# Altium schematic sheet ver061_ADC.SchDoc
size A3; SheetNumber: 2; SheetTotal: 6
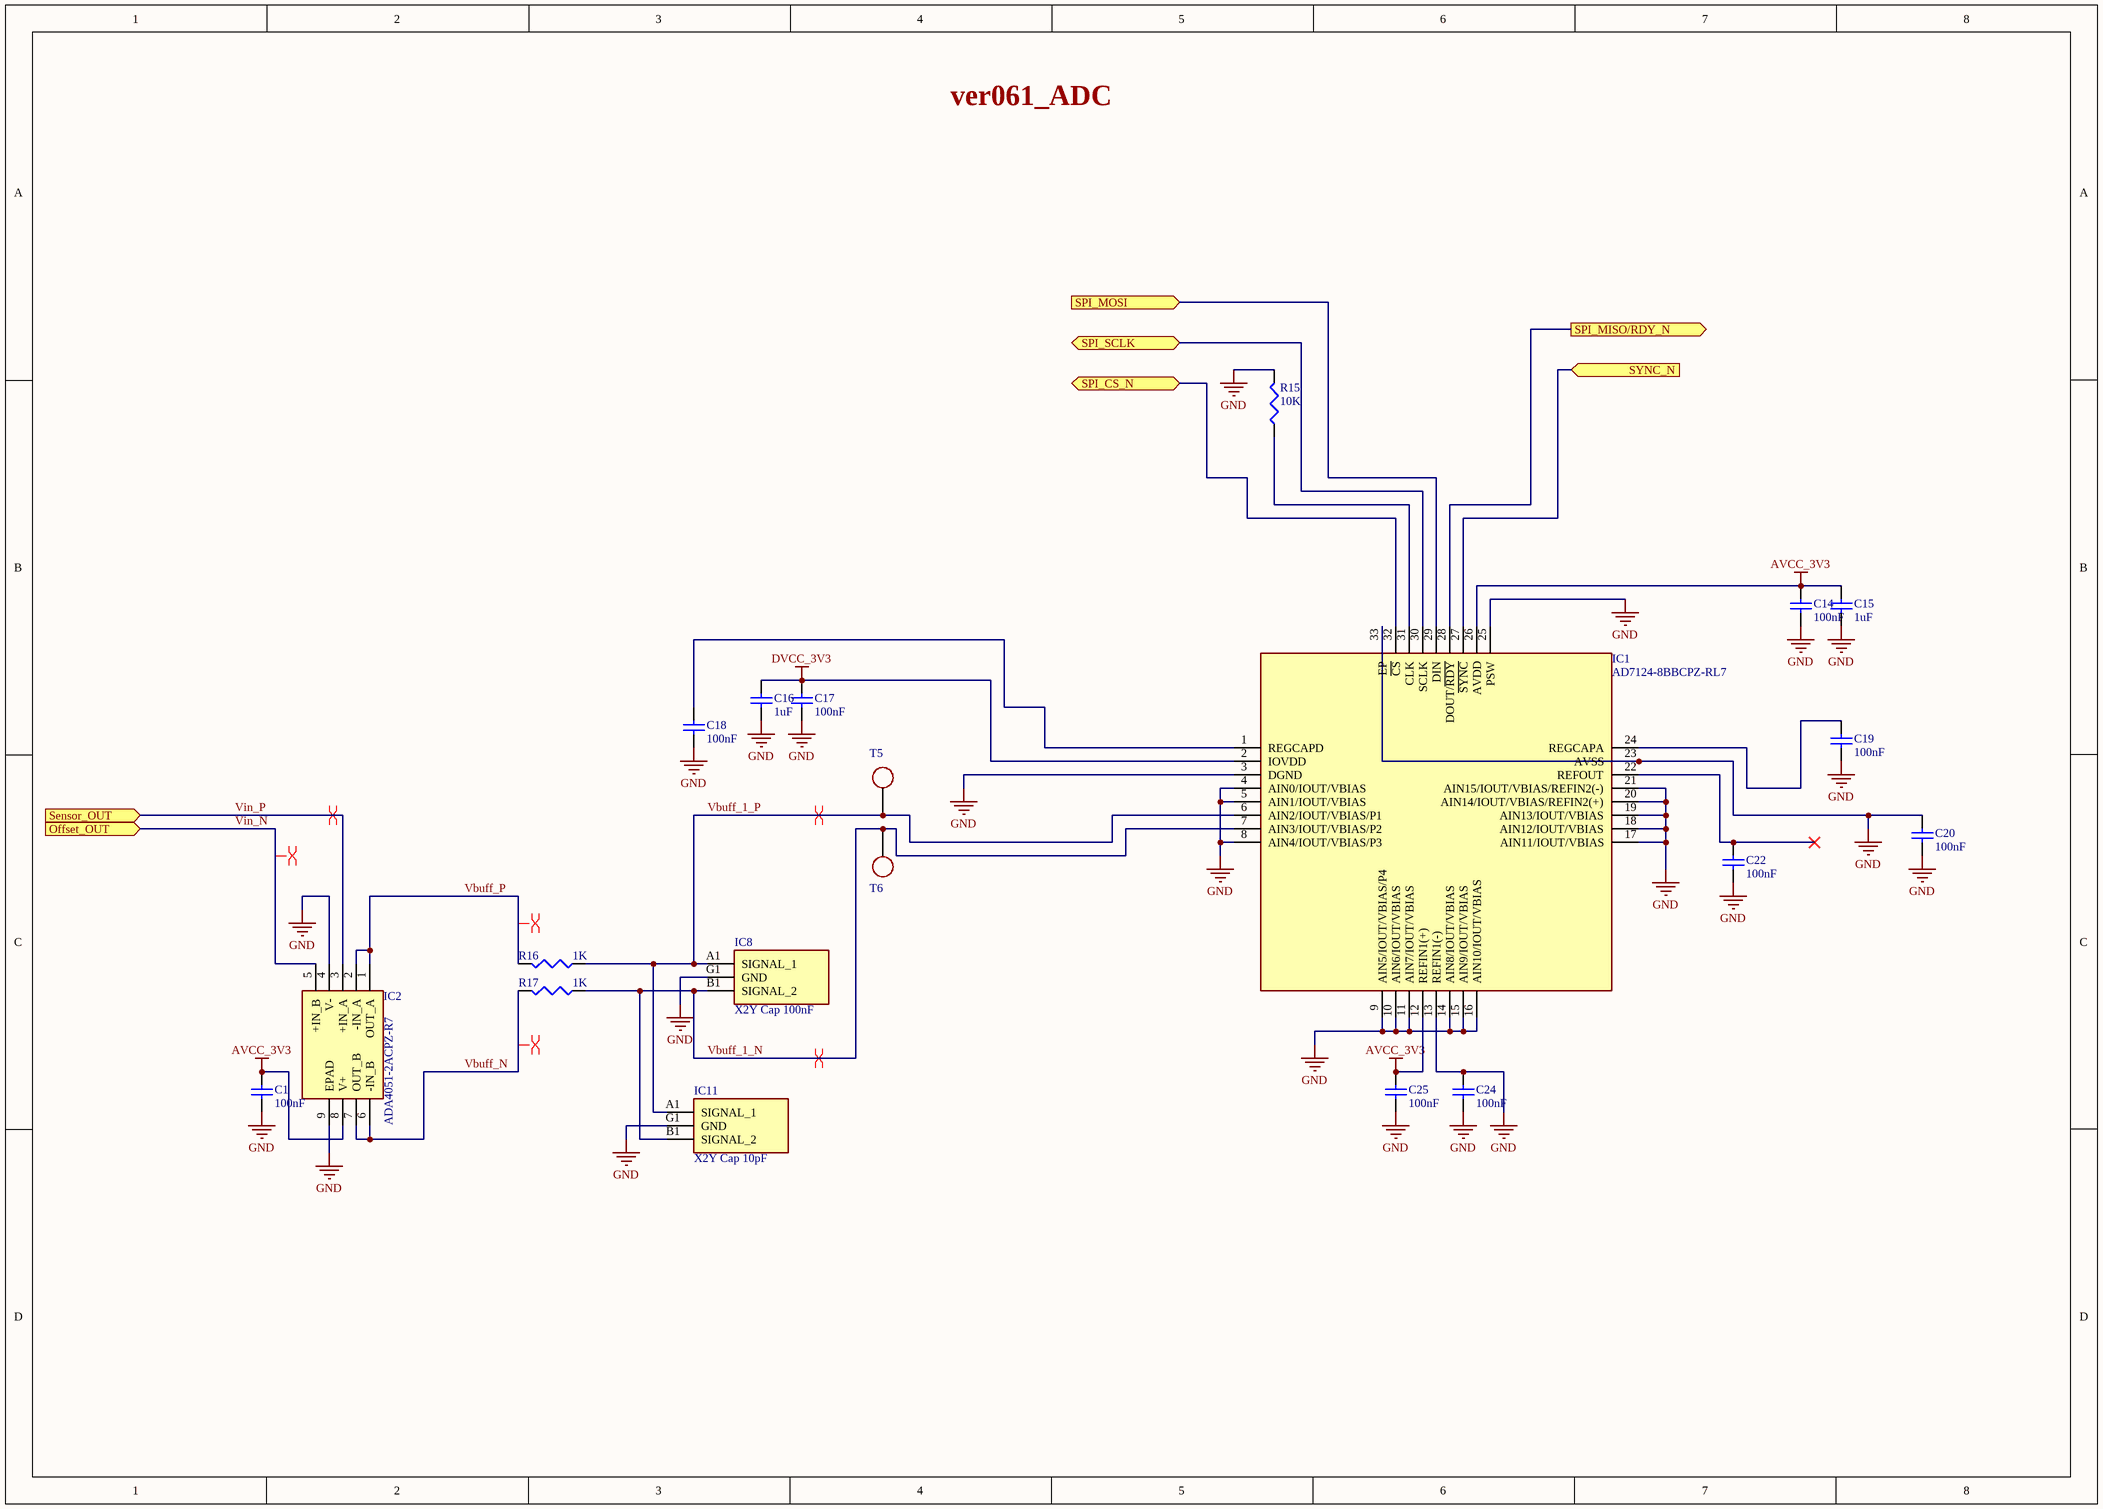
[diagram p0: ver061_ADC.SchDoc]

## Parts
C1  value 100nF  [1608[0603]]  (hidden comment: Cap Semi)
C14  value 100nF  [0402]  (hidden comment: Cap Semi)
C15  value 1uF  [0402]  (hidden comment: Cap Semi)
C16  value 1uF  [0402]  (hidden comment: Cap Semi)
C17  value 100nF  [0402]  (hidden comment: Cap Semi)
C18  value 100nF  [0402]  (hidden comment: Cap Semi)
C19  value 100nF  [0402]  (hidden comment: Cap Semi)
C20  value 100nF  [0402]  (hidden comment: Cap Semi)
C22  value 100nF  [0402]  (hidden comment: Cap Semi)
C24  value 100nF  [0402]  (hidden comment: Cap Semi)
C25  value 100nF  [0402]  (hidden comment: Cap Semi)
IC1  AD7124-8BBCPZ-RL7  [QFN50P500X500X100-33N-D]
IC2  ADA4051-2ACPZ-R7  [DFN300X300X90-9N]
IC8  X2Y Cap 100nF  [500X14W102MV4T]
IC11  X2Y Cap 10pF  [500X14W102MV4T]
R15  value 10K  [RESC1005X35N]  (hidden comment: Res3)
R16  value 1K  [RESC1005X35N]  (hidden comment: Res3)
R17  value 1K  [RESC1005X35N]  (hidden comment: Res3)
T5  TP_SMT  [TP_SMT_Round_0.6x0.6]  (value not drawn)
T6  TP_SMT  [TP_SMT_Round_0.6x0.6]  (value not drawn)

## Ports
Offset_OUT (in), Sensor_OUT (in), SPI_CS_N (bidir), SPI_MISO/RDY_N (out), SPI_MOSI (in), SPI_SCLK (bidir), SYNC_N (in)

## Nets
AVCC_3V3: C1.1 C14.1 C15.1 C25.1 IC1.12(REFIN1(+)) IC1.26(AVDD) IC2.8(V+)
DVCC_3V3: C16.1 C17.1 IC1.2(IOVDD)
GND: C1.2 C14.2 C15.2 C16.2 C17.2 C18.2 C19.2 C20.1 C20.2 C22.2 C24.1 C24.2 C25.2 IC1.3(DGND) IC1.4(AIN0/IOUT/VBIAS) IC1.5(AIN1/IOUT/VBIAS) IC1.8(AIN4/IOUT/VBIAS/P3) IC1.9(AIN5/IOUT/VBIAS/P4) IC1.10(AIN6/IOUT/VBIAS) IC1.11(AIN7/IOUT/VBIAS) IC1.13(REFIN1(-)) IC1.14(AIN8/IOUT/VBIAS) IC1.15(AIN9/IOUT/VBIAS) IC1.16(AIN10/IOUT/VBIAS) IC1.17(AIN11/IOUT/VBIAS) IC1.18(AIN12/IOUT/VBIAS) IC1.19(AIN13/IOUT/VBIAS) IC1.20(AIN14/IOUT/VBIAS/REFIN2(+)) IC1.21(AIN15/IOUT/VBIAS/REFIN2(-)) IC1.23(AVSS) IC1.25(PSW) IC1.33(EP) IC2.4(V-) IC2.9(EPAD) IC8.G1(GND) IC11.G1(GND) R15.2
SPI_CS_N: IC1.32(~{CS}) ; port SPI_CS_N
SPI_MISO/RDY_N: IC1.28(DOUT/~{RDY}) ; port SPI_MISO/RDY_N
SPI_MOSI: IC1.29(DIN) ; port SPI_MOSI
SPI_SCLK: IC1.30(SCLK) ; port SPI_SCLK
SYNC_N: IC1.27(~{SYNC}) ; port SYNC_N
Vbuff_1_N: IC1.7(AIN3/IOUT/VBIAS/P2) IC8.B1(SIGNAL_2) IC11.B1(SIGNAL_2) R17.1 T6.1
Vbuff_1_P: IC1.6(AIN2/IOUT/VBIAS/P1) IC8.A1(SIGNAL_1) IC11.A1(SIGNAL_1) R16.1 T5.1
Vbuff_N: IC2.6(-IN_B) IC2.7(OUT_B) R17.2
Vbuff_P: IC2.1(OUT_A) IC2.2(-IN_A) R16.2
Vin_N: IC2.5(+IN_B) ; port Offset_OUT
Vin_P: IC2.3(+IN_A) ; port Sensor_OUT
NetC18_1: C18.1 IC1.1(REGCAPD)
NetC19_1: C19.1 IC1.24(REGCAPA)
NetC22_1: C22.1 IC1.22(REFOUT)
NetIC1_31: IC1.31(CLK) R15.1

## Layout directives
differential pair: Vbuff_1_N, Vbuff_1_P, Vbuff_N, Vbuff_P, Vin_N, Vin_P

## Notes on the sheet
- ver061_ADC

## Library data of the parts
C1 C14-C20 C22 C24 C25 = Cap Semi: Capacitor (Semiconductor SIM Model); Published: 8-Jun-2000; LatestRevisionDate: 29-May-2009; LatestRevisionNote: IPC-7351 Footprint Added.; PackageReference: C1206; Publisher: Altium Limited; PackageDescription: Chip Capacitor
IC1 = AD7124-8BBCPZ-RL7: Integrated Circuit; Manufacturer_Name: Analog Devices; Datasheet Link: https://www.analog.com/media/en/technical-documentation/data-sheets/ad7124-8.pdf; Height: 1mm; Manufacturer_Part_Number: AD7124-8BBCPZ-RL7; Mouser Part Number: 584-AD7124-8BBCPZRL7; Mouser Price/Stock: https://www.mouser.co.uk/ProductDetail/Analog-Devices/AD7124-8BBCPZ-RL7?qs=wUXugUrL1qzAxcMt7nmw0w%3D%3D; Arrow Part Number: AD7124-8BBCPZ-RL7; Arrow Price/Stock: https://www.arrow.com/en/products/ad7124-8bbcpz-rl7/analog-devices?region=nac
IC2 = ADA4051-2ACPZ-R7: Integrated Circuit; Manufacturer_Name: Analog Devices; Manufacturer_Part_Number: ADA4051-2ACPZ-R7; Mouser Part Number: 584-ADA4051-2ACPZ-R7; Mouser Price/Stock: https://www.mouser.co.uk/ProductDetail/Analog-Devices/ADA4051-2ACPZ-R7?qs=BpaRKvA4VqFJoopj8kXVMQ%3D%3D; Arrow Part Number: ADA4051-2ACPZ-R7; Arrow Price/Stock: https://www.arrow.com/en/products/ada4051-2acpz-r7/analog-devices
IC8 IC11 = 500X14W102MV4T: Integrated Circuit; Manufacturer_Name: JOHANSON TECHNOLOGY; Datasheet Link: https://www.johansondielectrics.com/downloads/x2y-filter-and-decoupling-capacitors.pdf; Height: 0.66mm; Manufacturer_Part_Number: 500X14W102MV4T; Mouser Part Number: 605-500X14W102MV4T; Mouser Price/Stock: https://www.mouser.co.uk/ProductDetail/Johanson-Dielectrics/500X14W102MV4T?qs=yCnrNFeXz%252Bg%252BGvc939b0KQ%3D%3D
R15-R17 = Res3: Resistor; Published: 8-Jun-2000; LatestRevisionDate: 29-May-2009; LatestRevisionNote: IPC-7351 Footprint Added.; PackageReference: J1-0603; Publisher: Altium Limited; PackageDescription: Chip Resistor